# EAGLE schematic Rectangular_Touch_Pad_V2.3 (EAGLE 9.5.2)
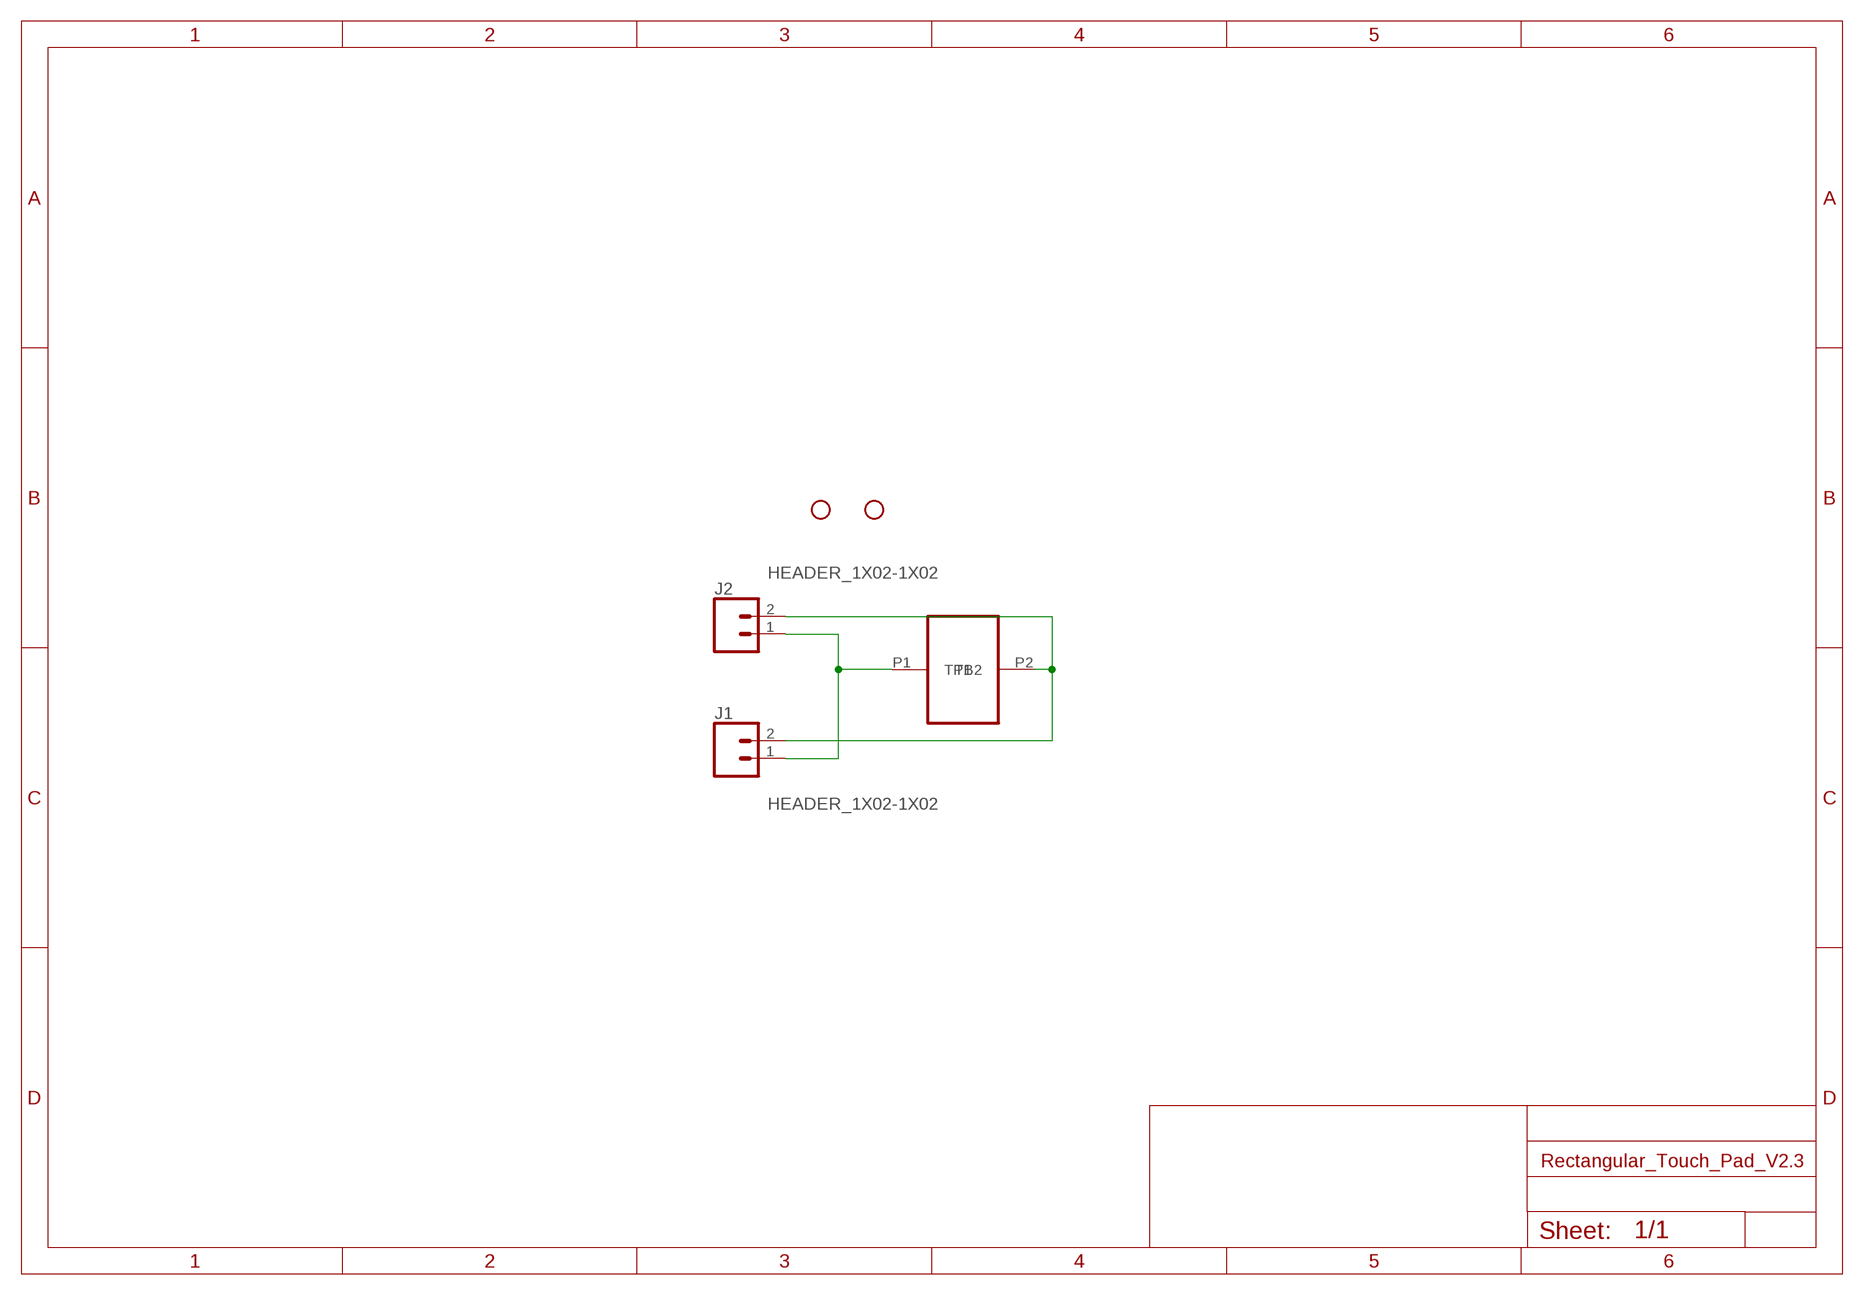
[diagram p0: schematic, sheet 1]

## Parts
H1  STAND-OFF-  [STAND-OFF]
H2  STAND-OFF-  [STAND-OFF]
J1  HEADER_1X02-1X02  [1X02]
J2  HEADER_1X02-1X02  [1X02]
U$1  TOUCHPAD-VER2.3  [TOUCHPAD-RECT-VER2.3]

## Nets
N$1: J1.1 J2.1 U$1.P1(TP1)
N$4: J1.2 J2.2 U$1.P2(TB2)

## Library data of the parts
H1 H2 = MMC Eagle:STAND-OFF-
J1 J2 = MMC Eagle:HEADER_1X02-
U$1 = MMC Eagle:TOUCHPAD-